# EAGLE schematic Arduino Detectors (EAGLE 7.4.0)
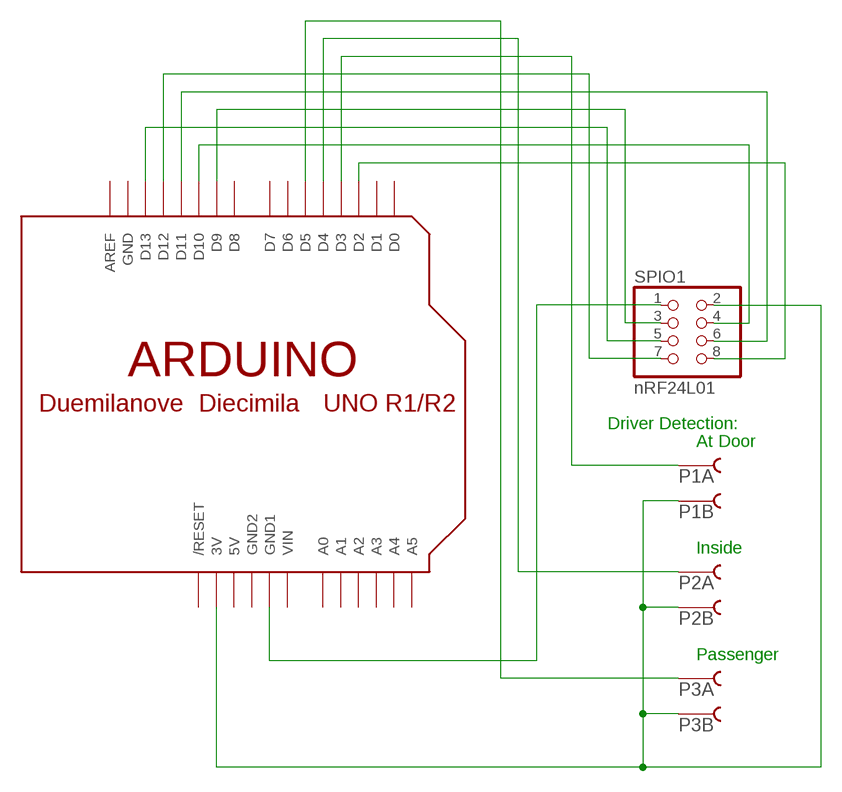
[diagram p0: schematic, sheet 1]

## Parts
P1  ATDOOR  TBLOCK2-LA  [30.202]
P2  INSIDE  TBLOCK2-LA  [30.202]
P3  PASSENGER  TBLOCK2-LA  [30.202]
SPIO1  nRF24L01  PINHD-2X4  [2X04]
U$1  ARDUINO-BPLACE  [ARDUINO-BPLACE]

## Nets
N$1: SPIO1.1 U$1.GND1
N$2: P1.2 P2.2 P3.2 SPIO1.2 U$1.3V
N$3: SPIO1.3 U$1.D9
N$4: SPIO1.4 U$1.D10
N$5: SPIO1.5 U$1.D13
N$6: SPIO1.6 U$1.D11
N$7: SPIO1.7 U$1.D12
N$8: SPIO1.8 U$1.D2
N$9: P1.1 U$1.D3
N$10: P2.1 U$1.D4
N$11: P3.1 U$1.D5
Unconnected: U$1.A0 U$1.A1 U$1.A2 U$1.A3 U$1.A4 U$1.A5 U$1.AREF U$1.D0 U$1.D1 U$1.D6 U$1.D7 U$1.D8 U$1.RESET(/RESET)

## Notes on the sheet
- Driver Detection:
- At Door
- Inside
- Passenger

## Power pins joined to a net without a drawn wire
5V: U$1.5V
GND: U$1.GND
GND2: U$1.GND2
VIN: U$1.VIN

## Library data of the parts
P1-P3 = connector:TBLOCK2-L: Terminal block, 2 pins; DESC: Terminal block; DVAL: .2" pitch, 2 conn; MANUF: Altech:30.202; SUPPLIER: Mouser:845-30.202; VALSTAT: label
SPIO1 = adafruit:PINHD-2X4: PIN HEADER
U$1 = adafruit:ARDUINO: Arduino Diecimila/Duemilanove Make a shield with ease, this package has all the named pins as well as the two mounting drill holes and an outline of the USB and DC power connector. The outline is on the DIMENSION layer, so if your board house uses it they will cut the outline to match. http://www.ladyada.net/library/pcb/eaglelibrary.html